# Altium schematic sheet Sheet1.SchDoc
size A; SheetNumber: 1; SheetTotal: 2
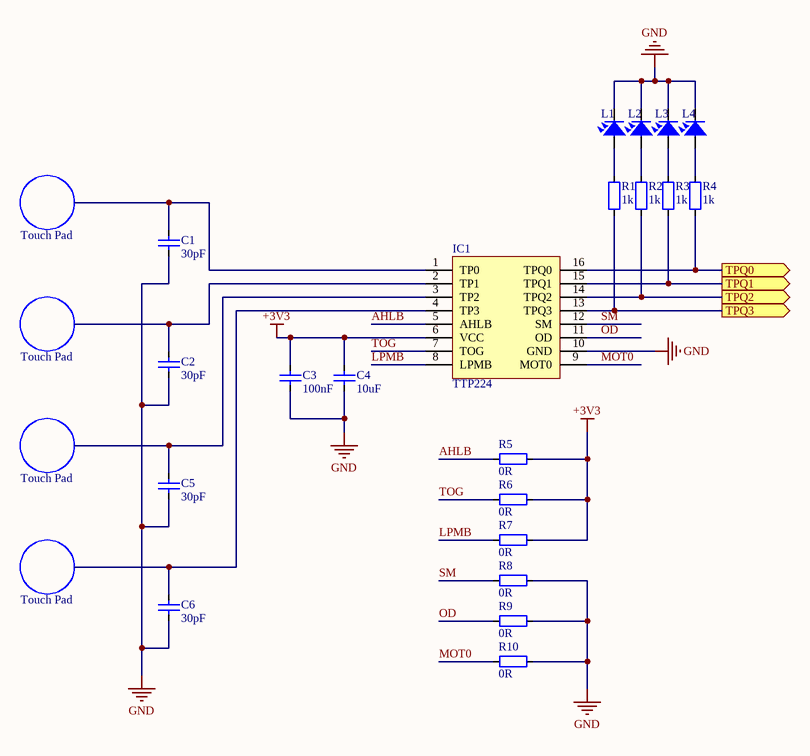
[diagram p0: Sheet1.SchDoc]

## Parts
C1  30pF  [CAP_0805]
C2  30pF  [CAP_0805]
C3  100nF  [CAP_0805]
C4  10uF  [CAP_0805]
C5  30pF  [CAP_0805]
C6  30pF  [CAP_0805]
IC1  TTP224
L1  LED  [LED-0805-Red]  (value not drawn)
L2  LED  [LED-0805-Red]  (value not drawn)
L3  LED  [LED-0805-Red]  (value not drawn)
L4  LED  [LED-0805-Red]  (value not drawn)
R1  1k  [RES-SMD-0805]
R2  1k  [RES-SMD-0805]
R3  1k  [RES-SMD-0805]
R4  1k  [RES-SMD-0805]
R5  0R  [RES-SMD-0805]
R6  0R  [RES-SMD-0805]
R7  0R  [RES-SMD-0805]
R8  0R  [RES-SMD-0805]
R9  0R  [RES-SMD-0805]
R10  0R  [RES-SMD-0805]

## Ports
TPQ0 (out), TPQ1 (out), TPQ2 (out), TPQ3 (out)

## Nets
+3V3: C3.2 C4.2 IC1.6(VCC) R5.2 R6.2 R7.2
GND: C1.1 C2.1 C3.1 C4.1 C5.1 C6.1 IC1.10(GND) L1.2 L2.2 L3.2 L4.2 R8.2 R9.2 R10.2
AHLB: IC1.5(AHLB) R5.1
LPMB: IC1.8(LPMB) R7.1
MOT0: IC1.9(MOT0) R10.1
OD: IC1.11(OD) R9.1
SM: IC1.12(SM) R8.1
TOG: IC1.7(TOG) R6.1
TPQ0: IC1.16(TPQ0) R4.1 ; port TPQ0
TPQ1: IC1.15(TPQ1) R3.1 ; port TPQ1
TPQ2: IC1.14(TPQ2) R2.1 ; port TPQ2
TPQ3: IC1.13(TPQ3) R1.1 ; port TPQ3
NetC1_2: C1.2 IC1.1(TP0)
NetC2_2: C2.2 IC1.2(TP1)
NetC5_2: C5.2 IC1.3(TP2)
NetC6_2: C6.2 IC1.4(TP3)
NetL1_1: L1.1 R1.2
NetL2_1: L2.1 R2.2
NetL3_1: L3.1 R3.2
NetL4_1: L4.1 R4.2

## Notes on the sheet
- Touch Pad

## Library data of the parts
C1-C6 = CapSMD: Capacitor; Value: 33p; Published: 8-Jun-2000; LatestRevisionDate: 17-Jul-2002; LatestRevisionNote: Re-released for DXP Platform.; PackageReference: RAD-0.3; Publisher: Altium Limited
L1-L4 = LED: LED Single colour Green and Red; Value: LED 3 ly Single Colour
R1-R10 = Resistor - SMD: Resistor; Manufacturer: Generic Components; Class: Passive; Published: 08/06/2000; Publisher: Altium Hobart Technology Centre